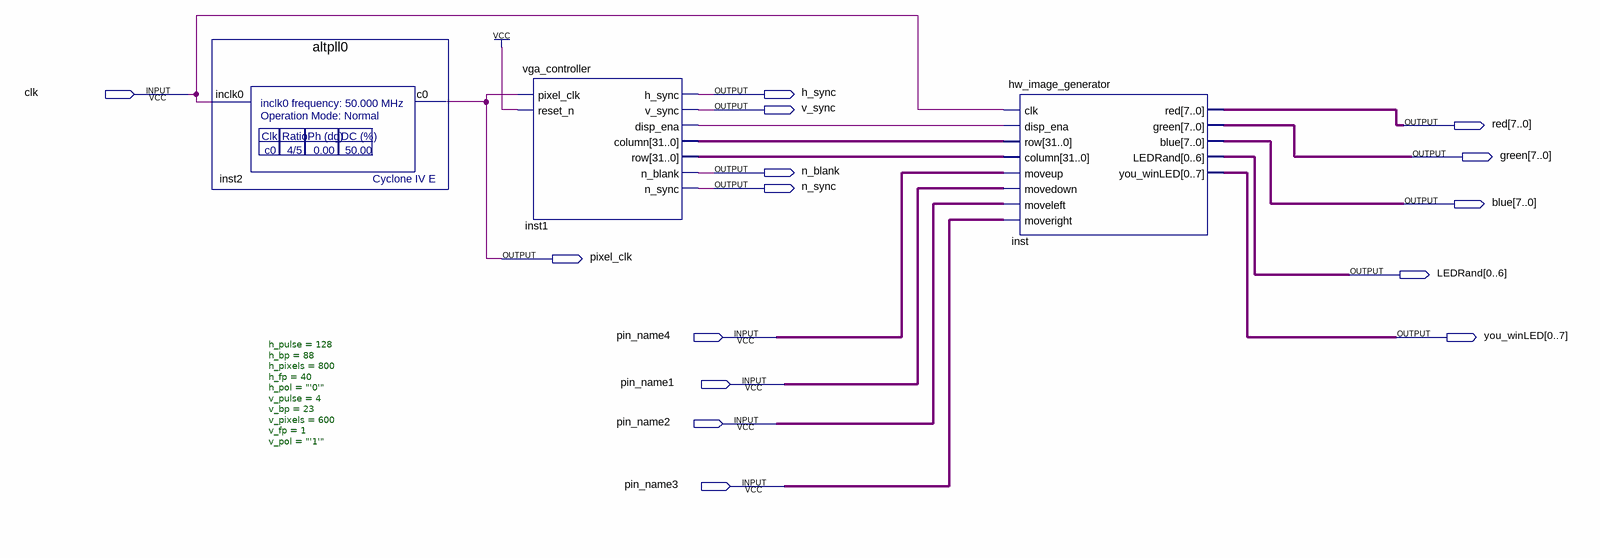
[diagram p0: schematic sheet]
// Quartus schematic BlockDiagramTesting.bdf as structural Verilog: 3 symbols, 15 pins
module BlockDiagramTesting (
  input  clk,
  input  pin_name4,
  input  pin_name1,
  input  pin_name2,
  input  pin_name3,
  output h_sync,
  output v_sync,
  output [7:0] red,
  output [7:0] green,
  output n_blank,
  output n_sync,
  output [7:0] blue,
  output pixel_clk,
  output [0:6] LEDRand,
  output [0:7] you_winLED
);

  wire inst1_disp_ena;
  wire [31:0] inst1_column, inst1_row;

  altpll0 inst2 (.inclk0(clk), .c0(pixel_clk));
  vga_controller #(.h_pulse(128), .h_bp(88), .h_pixels(800), .h_fp(40), .h_pol("'0'"), .v_pulse(4), .v_bp(23), .v_pixels(600), .v_fp(1), .v_pol("'1'")) inst1 (
    .pixel_clk(pixel_clk), .reset_n(1'b1), .h_sync(h_sync), .v_sync(v_sync), .disp_ena(inst1_disp_ena),
    .column(inst1_column), .row(inst1_row), .n_blank(n_blank), .n_sync(n_sync));
  hw_image_generator inst (
    .clk(clk), .disp_ena(inst1_disp_ena), .row(inst1_column), .column(inst1_row), .moveup(pin_name4),
    .movedown(pin_name1), .moveleft(pin_name2), .moveright(pin_name3), .red(red), .green(green), .blue(blue),
    .LEDRand(LEDRand), .you_winLED(you_winLED));
endmodule
